# Altium schematic sheet Sheet2.SchDoc
size A4
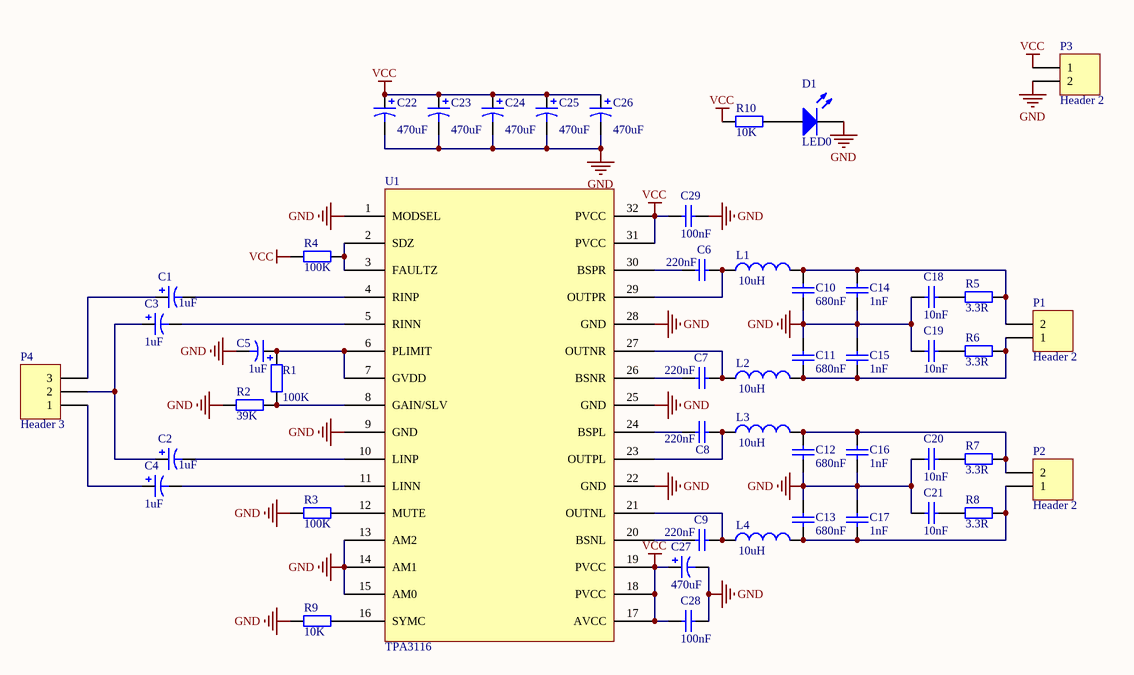
[diagram p0: Sheet2.SchDoc]

## Parts
C1  value 1uF  [C0603]  (hidden comment: Cap Pol1)
C2  value 1uF  [C0603]  (hidden comment: Cap Pol1)
C3  value 1uF  [C0603]  (hidden comment: Cap Pol1)
C4  value 1uF  [C0603]  (hidden comment: Cap Pol1)
C5  value 1uF  [C0603]  (hidden comment: Cap Pol1)
C6  value 220nF  [C0805]  (hidden comment: Cap)
C7  value 220nF  [C0805]  (hidden comment: Cap)
C8  value 220nF  [C0805]  (hidden comment: Cap)
C9  value 220nF  [C0805]  (hidden comment: Cap)
C10  value 680nF  [C0805]  (hidden comment: Cap)
C11  value 680nF  [C0805]  (hidden comment: Cap)
C12  value 680nF  [C0805]  (hidden comment: Cap)
C13  value 680nF  [C0805]  (hidden comment: Cap)
C14  value 1nF  [C0603]  (hidden comment: Cap)
C15  value 1nF  [C0603]  (hidden comment: Cap)
C16  value 1nF  [C0603]  (hidden comment: Cap)
C17  value 1nF  [C0603]  (hidden comment: Cap)
C18  value 10nF  [C0603]  (hidden comment: Cap)
C19  value 10nF  [C0603]  (hidden comment: Cap)
C20  value 10nF  [C0603]  (hidden comment: Cap)
C21  value 10nF  [C0603]  (hidden comment: Cap)
C22  value 470uF  [EC-470/25]  (hidden comment: Cap Pol1)
C23  value 470uF  [EC-470/25]  (hidden comment: Cap Pol1)
C24  value 470uF  [EC-470/25]  (hidden comment: Cap Pol1)
C25  value 470uF  [EC-470/25]  (hidden comment: Cap Pol1)
C26  value 470uF  [EC-470/25]  (hidden comment: Cap Pol1)
C27  value 470uF  [EC-470/25]  (hidden comment: Cap Pol1)
C28  value 100nF  [C0603]  (hidden comment: Cap)
C29  value 100nF  [C0603]  (hidden comment: Cap)
D1  LED0  [D0805]
L1  value 10uH  [L-12*12mm-S]  (hidden comment: Inductor)
L2  value 10uH  [L-12*12mm-S]  (hidden comment: Inductor)
L3  value 10uH  [L-12*12mm-S]  (hidden comment: Inductor)
L4  value 10uH  [L-12*12mm-S]  (hidden comment: Inductor)
P1  Header 2  [HX5.08-2]
P2  Header 2  [HX5.08-2]
P3  Header 2  [HX5.08-2]
P4  Header 3  [HX2.54-3]
R1  value 100K  [R0603]  (hidden comment: Res2)
R2  value 39K  [R0603]  (hidden comment: Res2)
R3  value 100K  [R0603]  (hidden comment: Res2)
R4  value 100K  [R0603]  (hidden comment: Res2)
R5  value 3.3R  [R0603]  (hidden comment: Res2)
R6  value 3.3R  [R0603]  (hidden comment: Res2)
R7  value 3.3R  [R0603]  (hidden comment: Res2)
R8  value 3.3R  [R0603]  (hidden comment: Res2)
R9  value 10K  [R0603]  (hidden comment: Res2)
R10  value 10K  [R0603]  (hidden comment: Res2)
U1  TPA3116  [HTSSOP32]

## Nets
GND: C5.2 C10.1 C11.2 C12.1 C13.2 C14.1 C15.2 C16.1 C17.2 C18.2 C19.2 C20.1 C21.1 C22.2 C23.2 C24.2 C25.2 C26.2 C27.2 C28.1 C29.1 D1.2(K) P3.2 R2.2 R3.1 R9.1 U1.1(MODSEL) U1.9(GND) U1.13(AM2) U1.14(AM1) U1.15(AM0) U1.22(GND) U1.25(GND) U1.28(GND)
VCC: C22.1 C23.1 C24.1 C25.1 C26.1 C27.1 C28.2 C29.2 P3.1 R4.2 R10.1 U1.17(AVCC) U1.18(PVCC) U1.19(PVCC) U1.31(PVCC) U1.32(PVCC)
NetC1_1: C1.1 P4.3
NetC1_2: C1.2 U1.4(RINP)
NetC2_1: C2.1 C3.1 P4.2
NetC2_2: C2.2 U1.10(LINP)
NetC3_2: C3.2 U1.5(RINN)
NetC4_1: C4.1 P4.1
NetC4_2: C4.2 U1.11(LINN)
NetC5_1: C5.1 R1.2 U1.6(PLIMIT) U1.7(GVDD)
NetC6_1: C6.1 U1.30(BSPR)
NetC6_2: C6.2 L1.1 U1.29(OUTPR)
NetC7_1: C7.1 U1.26(BSNR)
NetC7_2: C7.2 L2.1 U1.27(OUTNR)
NetC8_1: C8.1 U1.24(BSPL)
NetC8_2: C8.2 L3.1 U1.23(OUTPL)
NetC9_1: C9.1 U1.20(BSNL)
NetC9_2: C9.2 L4.1 U1.21(OUTNL)
NetC10_2: C10.2 C14.2 L1.2 P1.2 R5.2
NetC11_1: C11.1 C15.1 L2.2 P1.1 R6.2
NetC12_2: C12.2 C16.2 L3.2 P2.2 R7.1
NetC13_1: C13.1 C17.1 L4.2 P2.1 R8.1
NetC18_1: C18.1 R5.1
NetC19_1: C19.1 R6.1
NetC20_2: C20.2 R7.2
NetC21_2: C21.2 R8.2
NetD1_1: D1.1(A) R10.2
NetR1_1: R1.1 R2.1 U1.8(GAIN/SLV)
NetR3_2: R3.2 U1.12(MUTE)
NetR4_1: R4.1 U1.2(SDZ) U1.3(FAULTZ)
NetR9_2: R9.2 U1.16(SYMC)

## Library data of the parts
C1-C5 C22-C27 = Cap Pol1: Polarized Capacitor (Radial); Published: 8-Jun-2000; LatestRevisionDate: 17-Jul-2002; LatestRevisionNote: Re-released for DXP Platform.; PackageReference: RB7.6-15; Publisher: Altium Limited; PackageDescription: Polarized Capacitor (Radial); 2 Leads
C6-C21 C28 C29 = Cap: Capacitor; Published: 8-Jun-2000; LatestRevisionDate: 17-Jul-2002; LatestRevisionNote: Re-released for DXP Platform.; PackageReference: RAD-0.3; Publisher: Altium Limited; PackageDescription: Radial Cap, Thru-Hole; 2 Leads; 0.3 in Pin Spacing
D1 = LED0: Typical INFRARED GaAs LED; pin to pad: 1>A 2>K; Published: 8-Jun-2000; LatestRevisionDate: 08-Jul-2005; LatestRevisionNote: Mech Layer 1 removed.; PackageReference: LED-0; Publisher: Altium Limited; PackageDescription: LED; 2 Leads
L1-L4 = Inductor: Code_IEC: 1005; Published: 8-Jun-2000; LatestRevisionDate: 29-May-2009; LatestRevisionNote: IPC-7351 Footprint Added.; PackageReference: 0402-A; Publisher: Altium Limited; PackageDescription: Chip Inductor; Code_JEITA: 0402
P1-P3 = Header 2: Header, 2-Pin; LatestRevisionDate: 17-Jul-2002; LatestRevisionNote: Re-released for DXP Platform.; Publisher: Altium Limited
P4 = Header 3: Header, 3-Pin; LatestRevisionDate: 17-Jul-2002; LatestRevisionNote: Re-released for DXP Platform.; Publisher: Altium Limited
R1-R10 = Res2: Resistor; Published: 8-Jun-2000; LatestRevisionDate: 17-Jul-2002; LatestRevisionNote: Re-released for DXP Platform.; PackageReference: AXIAL-0.4; Publisher: Altium Limited; PackageDescription: Axial Device, Thru-Hole; 2 Leads; 0.4 in Pin Spacing